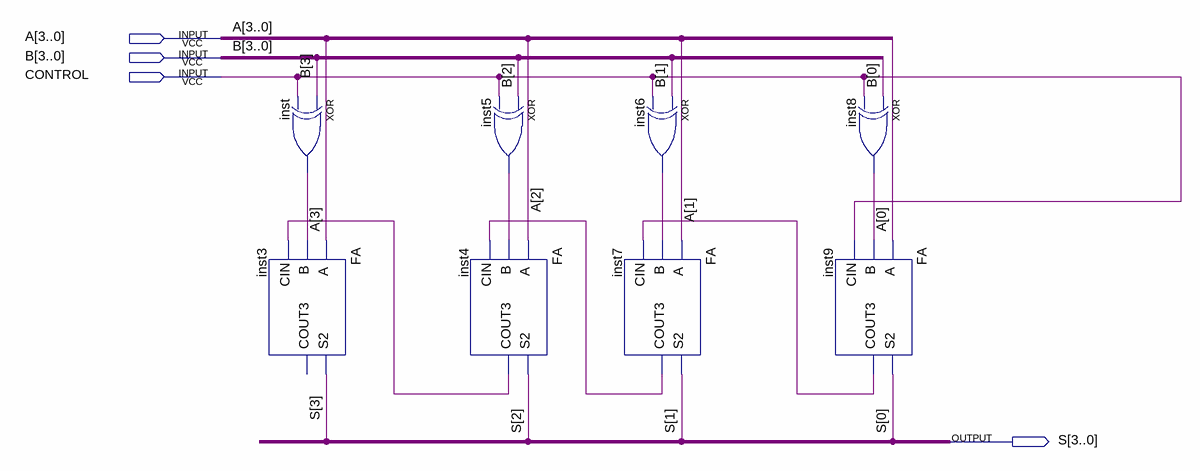
[diagram p0: schematic sheet]
// Quartus schematic CONGTRU4BIT.bdf as structural Verilog: 8 symbols, 4 pins
module CONGTRU4BIT (
  input  [3:0] A,
  input  [3:0] B,
  input  CONTROL,
  output [3:0] S
);

  wire inst4_cout3, inst5_out, inst6_out, inst7_cout3, inst8_out, inst9_cout3, inst_out;

  xor inst (inst_out, B[3], CONTROL);
  FA inst3 (.A(A[3]), .B(inst_out), .CIN(inst4_cout3), .S2(S[3]));  // open: COUT3
  FA inst4 (.A(A[2]), .B(inst5_out), .CIN(inst7_cout3), .S2(S[2]), .COUT3(inst4_cout3));
  xor inst5 (inst5_out, B[2], CONTROL);
  FA inst7 (.A(A[1]), .B(inst6_out), .CIN(inst9_cout3), .S2(S[1]), .COUT3(inst7_cout3));
  xor inst6 (inst6_out, B[1], CONTROL);
  FA inst9 (.A(A[0]), .B(inst8_out), .CIN(CONTROL), .S2(S[0]), .COUT3(inst9_cout3));
  xor inst8 (inst8_out, B[0], CONTROL);
endmodule
